# EAGLE design OneLedBlinker (EAGLE 7.2.0)
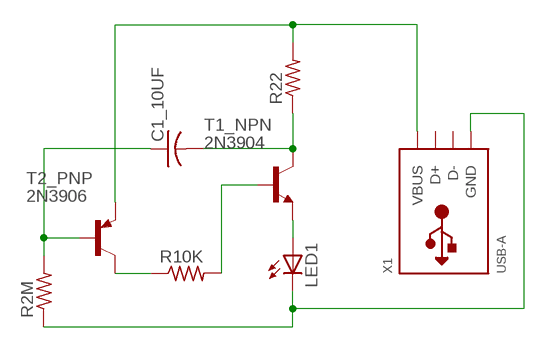
[diagram p0: schematic, sheet 1]

## Parts
C1_10UF  C-US025-030X050  [C025-030X050]
LED1  LED5MM  [LED5MM]
R2M  R-US_0207/10  [0207/10]
R10K  R-US_0207/10  [0207/10]
R22  R-US_0207/10  [0207/10]
T1_NPN  2N3904  [TO92]
T2_PNP  2N3906  [TO92]
X1  USB-A  [MOLEX_480371000]

## Nets
N$1: R22.2 T2_PNP.3(E) X1.1(VBUS)
N$2: C1_10UF.2 R22.1 T1_NPN.1(C)
N$3: LED1.A T1_NPN.3(E)
N$4: LED1.K(C) R2M.1 X1.4(GND)
N$5: C1_10UF.1 R2M.2 T2_PNP.2(B)
N$6: R10K.1 T2_PNP.1(C)
N$7: R10K.2 T1_NPN.2(B)
Unconnected: X1.2(D-) X1.3(D+)

## Library data of the parts
C1_10UF = adafruit:C-US: CAPACITOR, American symbol
LED1 = adafruit:LED: LED OSRAM: - CHIPLED LG R971, LG N971, LY N971, LG Q971, LY Q971, LO R971, LY R971 LH N974, LH R974 LS Q976, LO Q976, LY Q976 LO Q996 - Hyper CHIPLED LW Q18S LB Q993, LB Q99A, LB R99A - SideLED LS A670, LO A670, LY A670, LG A670, LP A670 LB A673, LV A673, LT A673, LW A673 LH A674 LY A675 LS A676, LA A676, LO A676, LY A676, LW A676 LS A679, LY A679, LG A679 - Hyper Micro SIDELED® LS Y876, LA Y876, LO Y876, LY Y876 LT Y87S - SmartLED LW L88C, LW L88S LB L89C, LB L89S, LG L890 LS L89K, LO L89K, LY L89K LS L896, LA L896, LO L896, LY L896 - TOPLED LS T670, LO T670, LY T670, LG T670, LP T670 LSG T670, LSP T670, LSY T670, LOP T670, LYG T670 LG T671, LOG T671, LSG T671 LB T673, LV T673, LT T673, LW T673 LH T674 LS T676, LA T676, LO T676, LY T676, LB T676, LH T676, LSB T676, LW T676 LB T67C, LV T67C, LT T67C, LS T67K, LO T67K, LY T67K, LW E67C LS E67B, LA E67B, LO E67B, LY E67B, LB E67C, LV E67C, LT E67C LW T67C LS T679, LY T679, LG T679 LS T770, LO T770, LY T770, LG T770, LP T770 LB T773, LV T773, LT T773, LW T773 LH T774 LS E675, LA E675, LY E675, LS T675 LS T776, LA T776, LO T776, LY T776, LB T776 LHGB T686 LT T68C, LB T68C - Hyper Mini TOPLED® LB M676 - Mini TOPLED Santana® LG M470 LS M47K, LO M47K, LY M47K Source: http://www.osram.convergy.de/
R2M R10K R22 = adafruit:R-US_: RESISTOR, American symbol
T1_NPN = transistor:2N3904: NPN TRANSISTOR
T2_PNP = transistor-pnp:2N3906: PNP Transistor
X1 = adafruit:USB-A: USB type A 'plug' Used for things that can directly connect to a USB port, say USB key

## Board
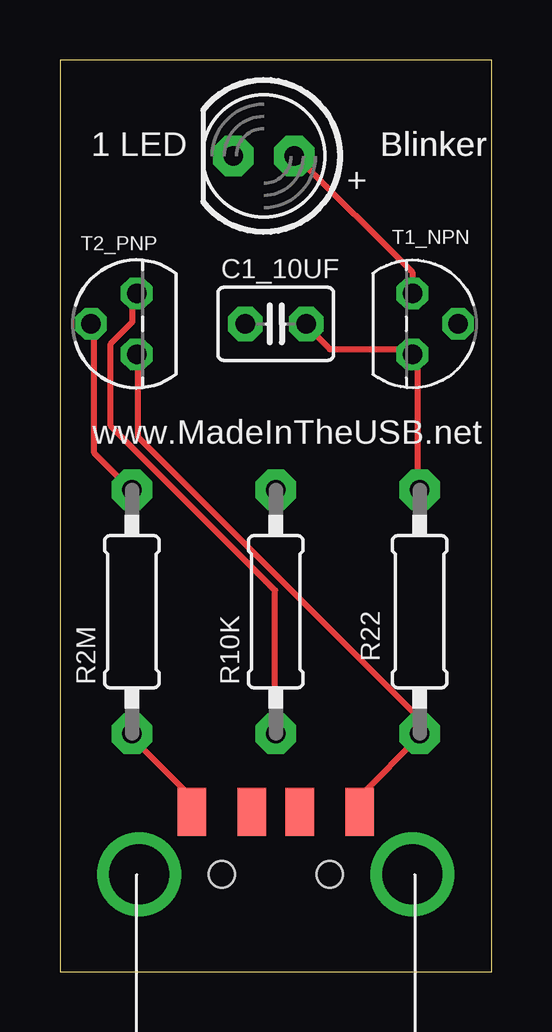
[diagram p1: board, top side]
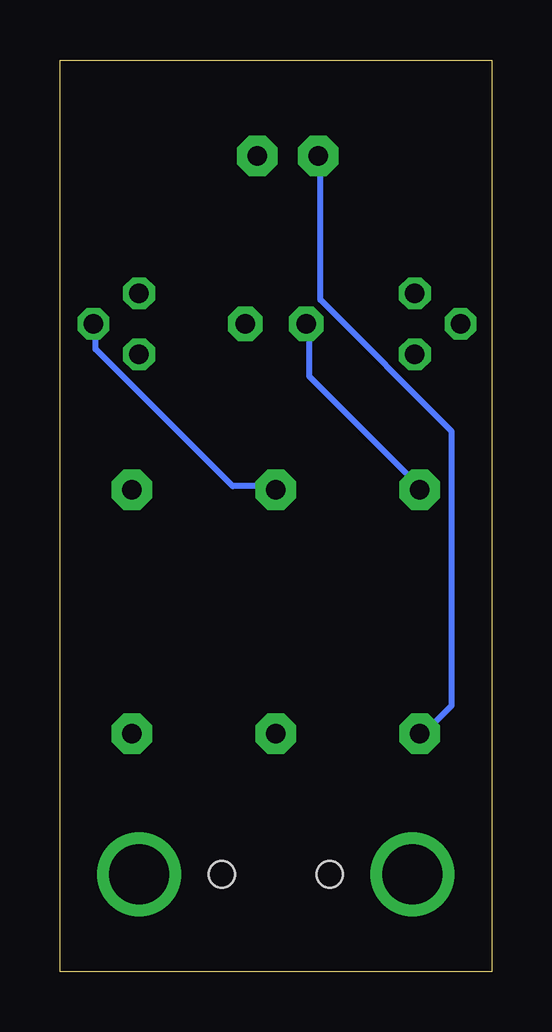
[diagram p2: board, bottom side, seen from below]

Size 18 x 38 mm. Coordinates in mm from the lower left corner, seen from the top.
Outline: 0,0 18,0 18,38 0,38 0,0
Copper layers (1*16): Top 0.035mm / dielectric 1.5mm / Bottom 0.035mm
Design rules "default": minimum track width 10mil, minimum drill 24mil, track to track 8mil, track to pad 8mil, pad to pad 8mil, via to via 8mil, smd to smd 8mil, copper to edge 40mil, drill to drill 8mil, minimum pad ring 10mil, minimum via ring 8mil, stop-mask expansion 4mil, vias tented up to drill 0mil, thermal gap 10mil

### Footprints (pad centres in the part's own frame; a part is rotated, then mirrored left to right if it is on the bottom)
C025-030X050 = drill 0.813 pad 1.422 octagon: 1 -1.27,0; 2 1.27,0
LED5MM = drill 0.813 pad 1.676 octagon: A -1.27,0; K 1.27,0
0207/10 = drill 0.813 pad 1.676 octagon: 1 -5.08,0; 2 5.08,0
TO92 = drill 0.813 octagon: 1 1.27,0; 2 0,1.905; 3 -1.27,0
MOLEX_480371000 = smd 1.2 x 2: 1 3.5,2.6; 2 1,2.6; 3 -1,2.6; 4 -3.5,2.6 | drill 2.5: M1 -5.7,0; M2 5.7,0 | hole 1.1: -2.25,0; 2.25,0

### Placement (x,y rotation side)
C1_10UF  9,27 0 top
LED1  8.5,34 180 top
R2M  3,15 90 top
R10K  9,15 90 top
R22  15,15 270 top
T1_NPN  14.7,27 270 top
T2_PNP  3.2,27 90 top
X1  9,4.05 0 top

### Tracks (layer width: path | path; a pad name or v marks a point on that pad's centre or on a via)
N$1
  Top 0.254: X1.1 12.63,6.75 12.63,7.43 14.92,9.72 R22.2 14.92,9.95 14.92,10.63 3.26,22.29 3.26,25.72 T2_PNP.3
N$2
  Top 0.254: C1_10UF.2 10.34,26.86 11.26,25.95 14.69,25.95 T1_NPN.1 14.92,25.72 14.92,20.23 R22.1
N$3
  Top 0.254: T1_NPN.3 14.69,28.46 14.69,29.15 9.89,33.95 LED1.A
N$4
  Top 0.254: X1.4 5.32,6.75 5.32,7.43 3.03,9.72 R2M.1
  Bottom 0.254: LED1.K 7.14,33.95 7.14,28.01 1.66,22.52 1.66,11.09 2.8,9.95 R2M.1
N$5
  Top 0.254: T2_PNP.2 1.43,26.86 1.43,21.6 2.8,20.23 R2M.2
  Bottom 0.254: C1_10UF.1 7.6,26.86 7.6,24.8 3.03,20.23 R2M.2
N$6
  Top 0.254: T2_PNP.1 3.03,28.23 3.03,27.09 2.12,26.18 2.12,22.75 8.97,15.89 8.97,9.95 R10K.1
N$7
  Bottom 0.254: T1_NPN.2 16.52,26.86 16.52,25.95 10.8,20.23 9.2,20.23 R10K.2

### Text on the board
tNames: 1 LED | Blinker | Blinker | + | www.MadeInTheUSB.net